# EAGLE design MotorConnection (EAGLE 7.7.0)
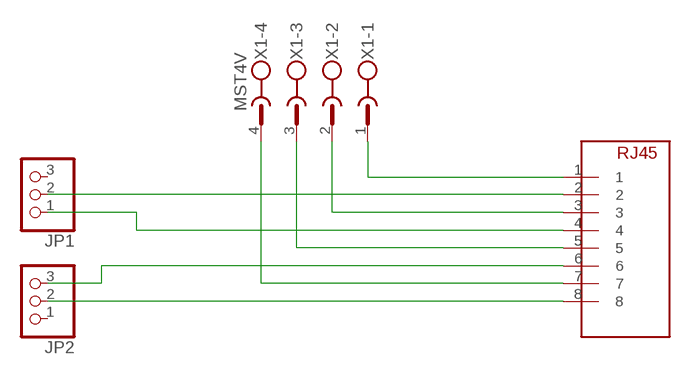
[diagram p0: schematic, sheet 1]

## Parts
JP1  PINHD-1X3  [1X03]
JP2  PINHD-1X3  [1X03]
WEIDMUELLER_RJ1  WEIDMUELLER_RJ45  [WEIDMUELLER_RJ45]
X1  MST4V  [MSTBV4]

## Nets
N$1: JP1.2 WEIDMUELLER_RJ1.2
N$2: JP1.1 WEIDMUELLER_RJ1.4
N$3: JP2.2 WEIDMUELLER_RJ1.8
N$4: JP2.3 WEIDMUELLER_RJ1.6
N$5: WEIDMUELLER_RJ1.1 X1.1
N$6: WEIDMUELLER_RJ1.3 X1.2
N$7: WEIDMUELLER_RJ1.5 X1.3
N$8: WEIDMUELLER_RJ1.7 X1.4
Unconnected: JP1.3 JP2.1

## Library data of the parts
JP1 JP2 = adafruit:PINHD-1X3: PIN HEADER
WEIDMUELLER_RJ1 = Weidmueller_RJ45_CAT6 T1U 2.7N4N:WEIDMUELLER_RJ45
X1 = con-phoenix-508:MST4V: PHOENIX; OC_FARNELL: unknown; OC_NEWARK: unknown

## Board
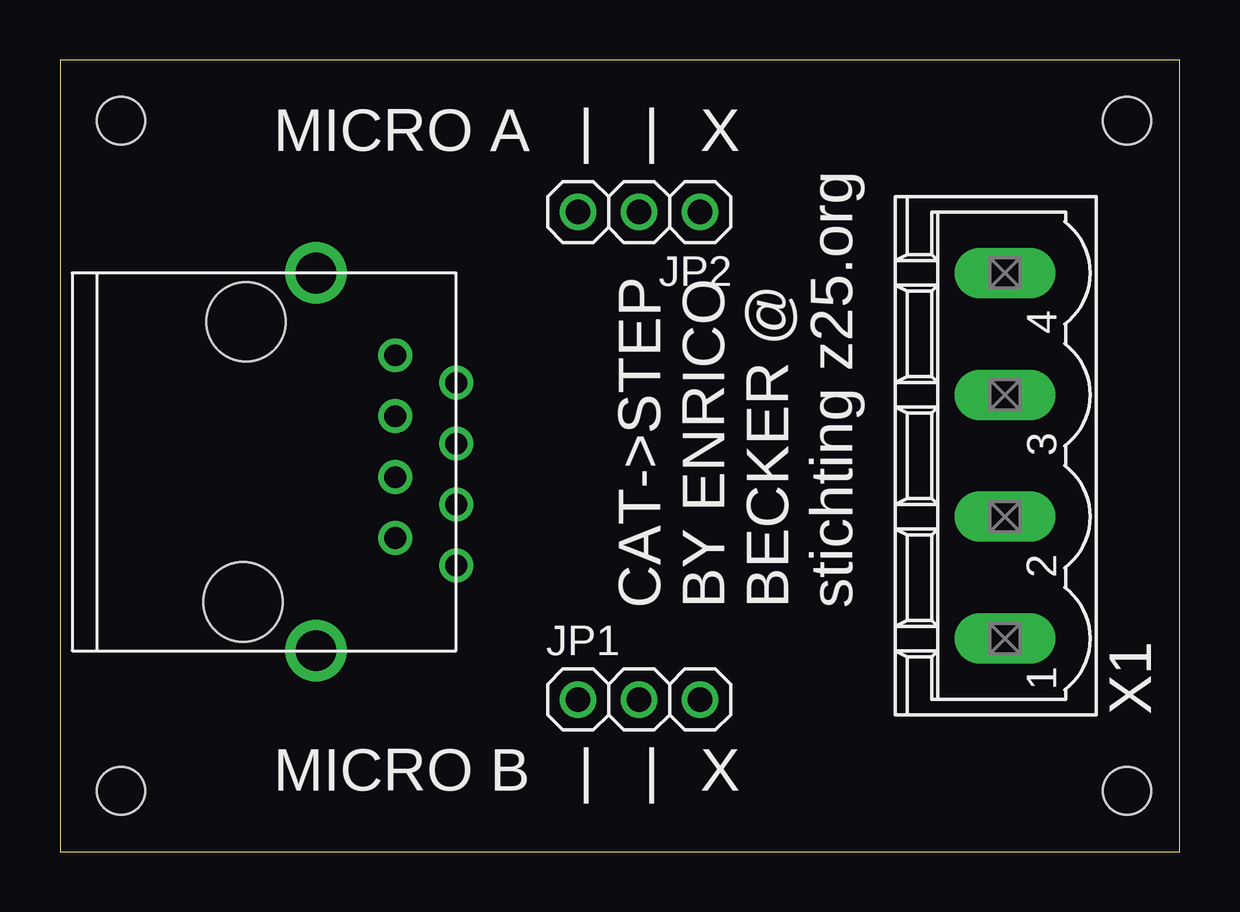
[diagram p1: board, top side]
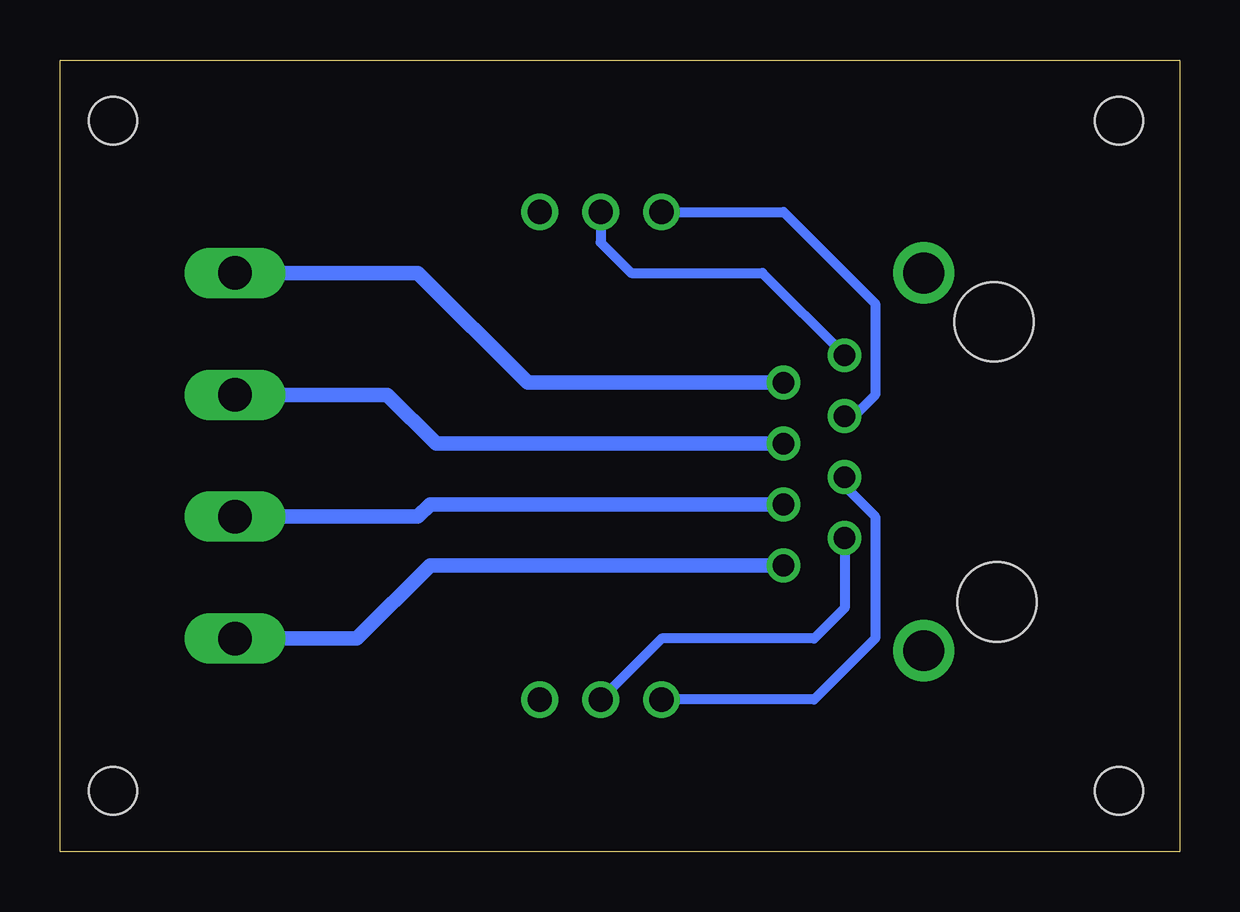
[diagram p2: board, bottom side, seen from below]

Size 46.66 x 33.01 mm. Coordinates in mm from the lower left corner, seen from the top.
Outline: 0,0 46.66,0 46.66,33.01 0,33.01 0,0
Copper layers (1*16): Top 0.035mm / dielectric 1.5mm / Bottom 0.035mm
Design rules "default": minimum track width 10mil, minimum drill 24mil, track to track 8mil, track to pad 8mil, pad to pad 8mil, via to via 8mil, smd to smd 8mil, copper to edge 40mil, drill to drill 8mil, minimum pad ring 10mil, minimum via ring 8mil, stop-mask expansion 4mil, vias tented up to drill 0mil, thermal gap 10mil
Holes 2 mm at 2.54,30.48 2.54,2.54 44.45,30.48 44.45,2.54

### Footprints (pad centres in the part's own frame; a part is rotated, then mirrored left to right if it is on the bottom)
1X03 = drill 1.016: 1 -2.54,0; 2 0,0; 3 2.54,0
WEIDMUELLER_RJ45 = drill 0.9 pad 1.27: 1 12.192,0; 2 11.049,-2.54; 3 9.652,0; 4 8.509,-2.54; 5 7.112,0; 6 5.969,-2.54; 7 4.572,0; 8 3.429,-2.54 | drill 1.702 pad 2.184: P$9 0,-5.842; P$10 15.748,-5.842 | hole 3.302: 2.032,-8.763; 13.716,-8.89
MSTBV4 = drill 1.397 long: 1 -7.62,0; 2 -2.54,0; 3 2.54,0; 4 7.62,0

### Placement (x,y rotation side)
JP1  24.13,6.35 0 top
JP2  24.13,26.67 180 top
WEIDMUELLER_RJ1  16.51,24.13 270 top
X1  39.37,16.51 90 top

### Tracks (layer width: path | path; a pad name or v marks a point on that pad's centre or on a via)
N$1
  Bottom 0.406: WEIDMUELLER_RJ1.2 13.97,10.16 15.24,8.89 21.59,8.89 JP1.2
N$2
  Bottom 0.406: WEIDMUELLER_RJ1.4 13.97,15.24 12.7,13.97 12.7,8.89 15.24,6.35 JP1.1
N$3
  Bottom 0.406: JP2.2 24.13,25.4 22.86,24.13 17.4,24.13 WEIDMUELLER_RJ1.8
N$4
  Bottom 0.406: JP2.3 16.51,26.67 12.7,22.86 12.7,19.05 13.97,17.78 WEIDMUELLER_RJ1.6
N$5
  Bottom 0.61: WEIDMUELLER_RJ1.1 31.24,11.94 34.29,8.89 X1.1
N$6
  Bottom 0.61: WEIDMUELLER_RJ1.3 31.24,14.48 31.75,13.97 X1.2
N$7
  Bottom 0.61: WEIDMUELLER_RJ1.5 30.99,17.02 33.02,19.05 X1.3
N$8
  Bottom 0.61: WEIDMUELLER_RJ1.7 27.18,19.56 31.75,24.13 X1.4

### Text on the board
tPlace: MICRO A | | | | X | CAT->STEP / BY ENRICO / BECKER @ / stichting z25.org | MICRO B | | | | X